# EasyEDA Pro project ProPrj_光伏汇流箱温度监控物联网网关_2026-04-27.epro

# Schematic 模板
Assembly Variant: Basic; Board Name: 模板; Create Date: 2026-04-27; Page Name: P1; Project Name: 模板; Schematic Name: 模板; Update Date: 2026-04-27; BladeWidth: 10; Company: 嘉立创EDA; Page Size: A4; RegionStart: 1; ShowBorder: 1; TitleBlock: 1; TitleBlockPosition: 3; Version: V1.0; XRegionCount: 6; YRegionCount: 4
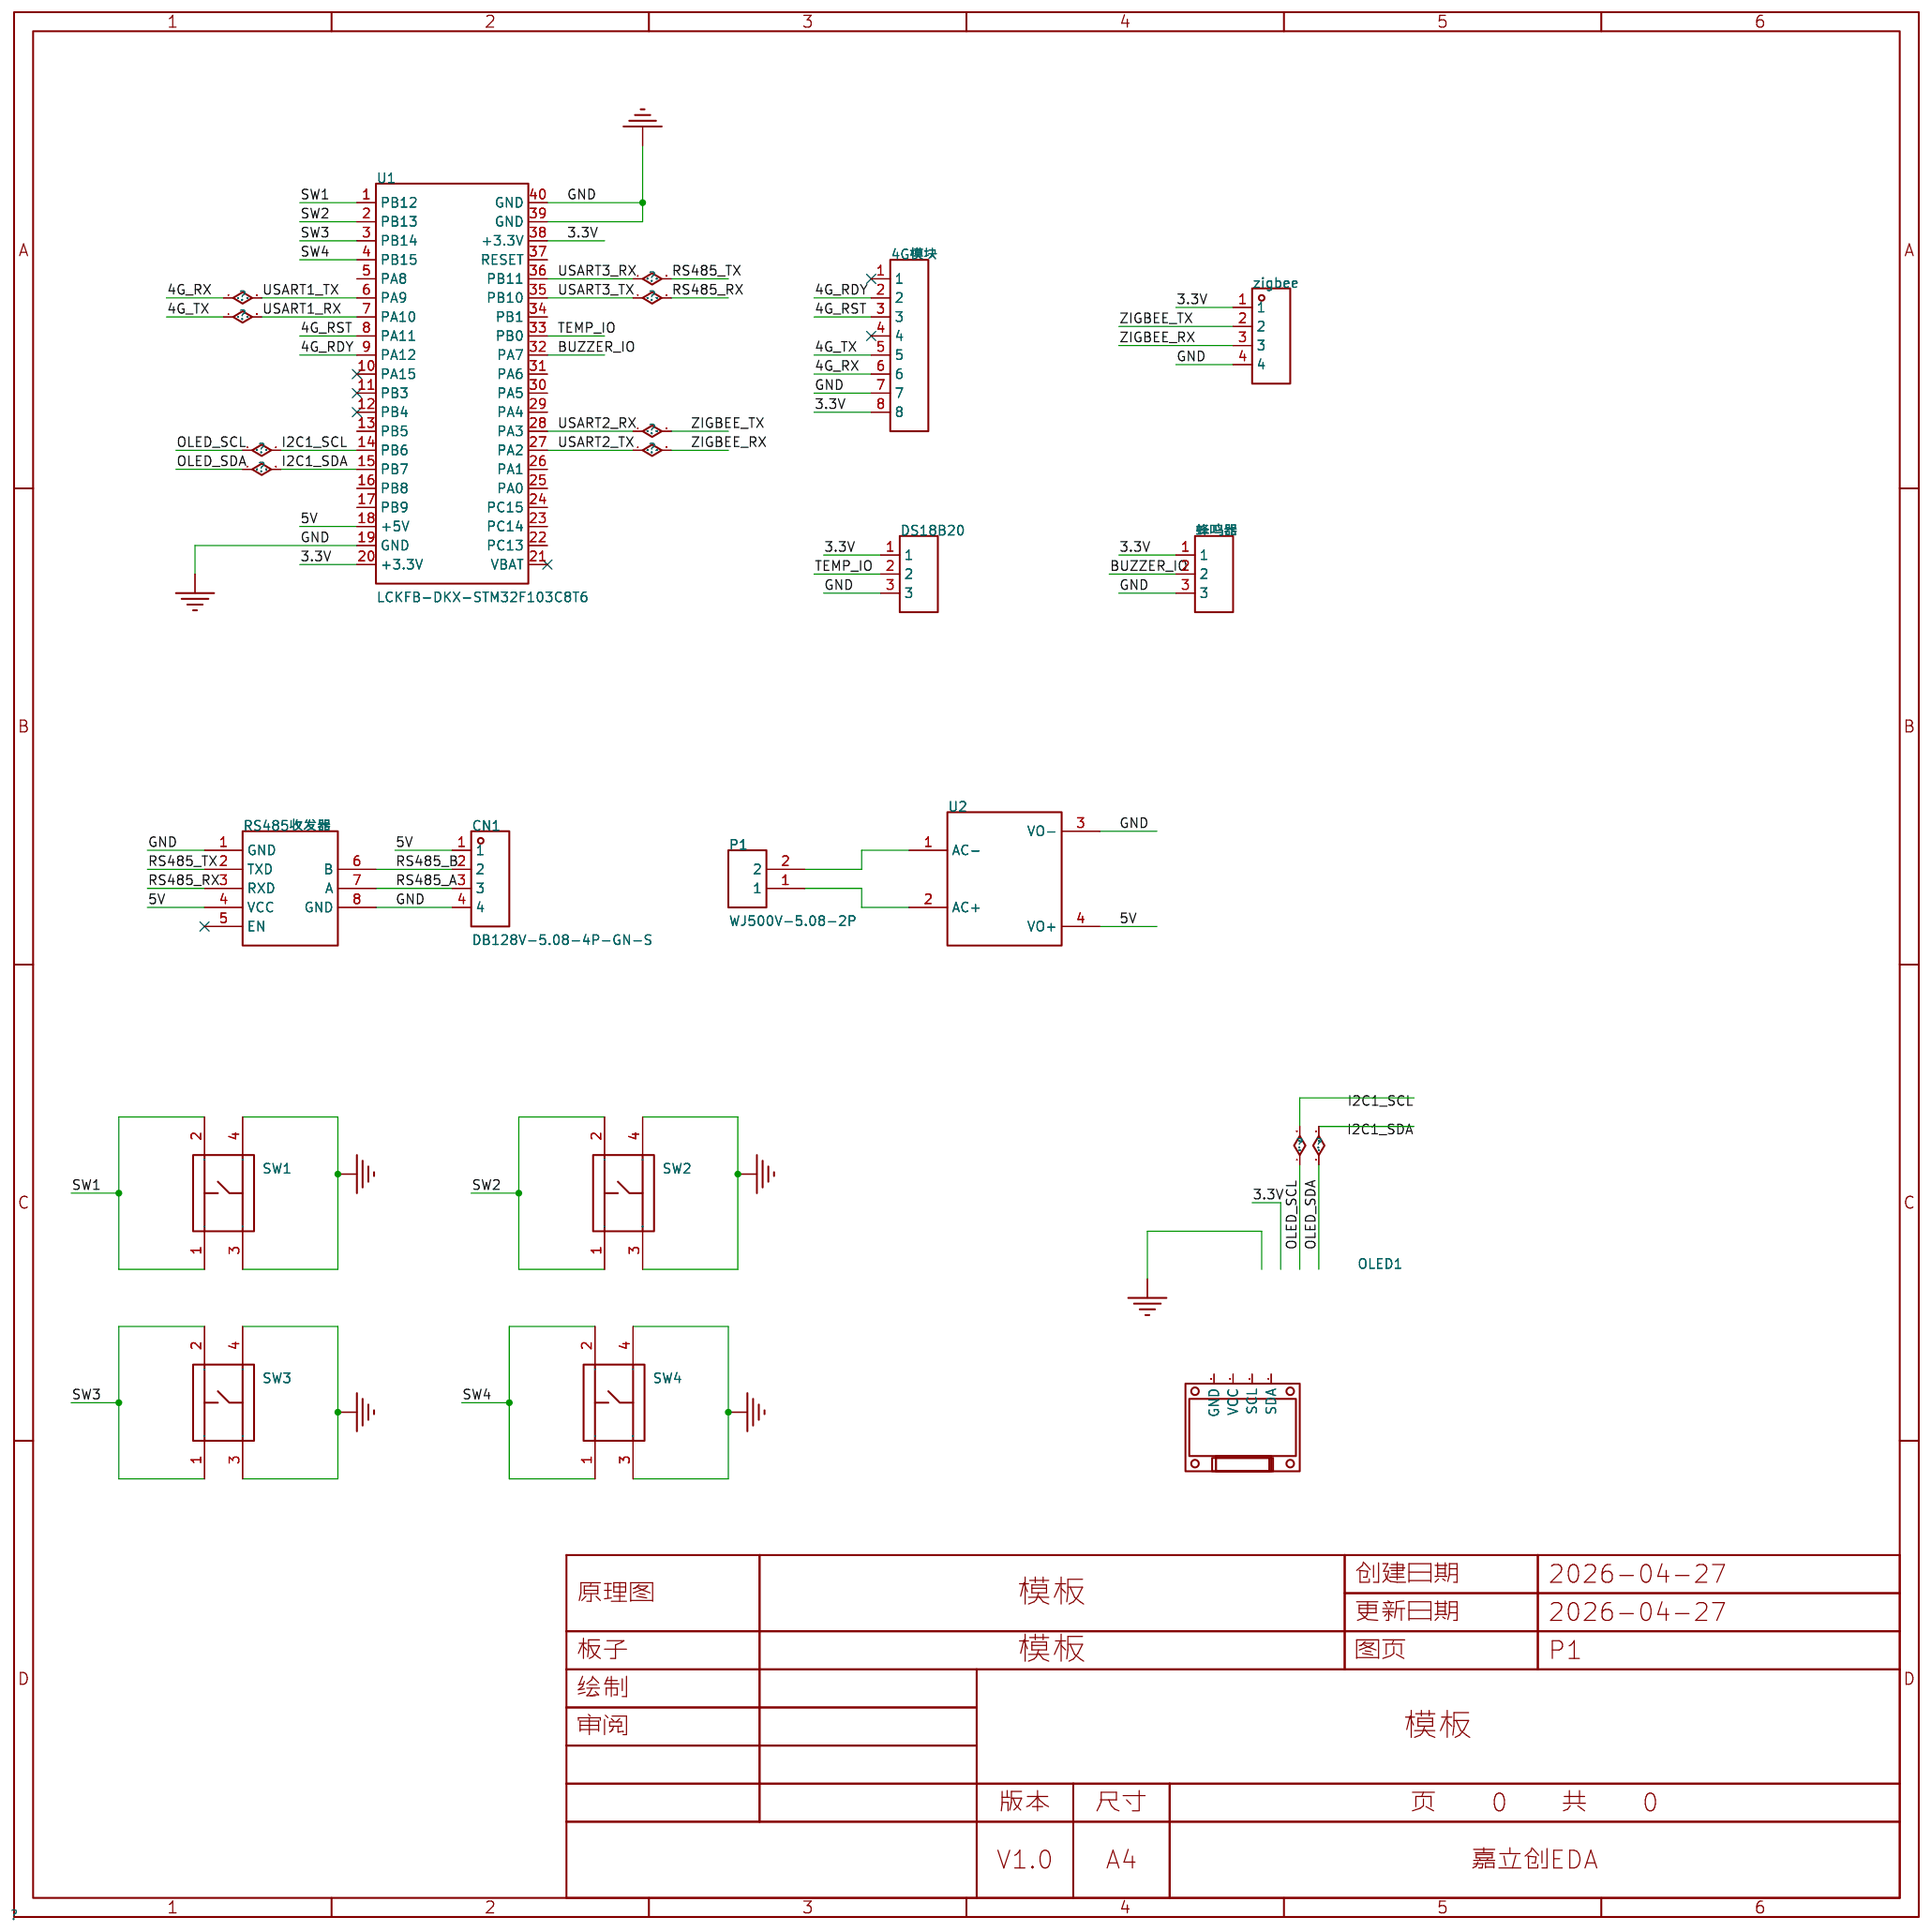
[diagram p0: schematic sheet]

## Parts
4G模块  -  [HDR-TH_8P-P2.54-V-F-1]
CN1  DB128V-5.08-4P-GN-S  [CONN-TH_4P-P5.08_DIBO_DB128V-5.08]
DS18B20  -  [HDR-TH_3P-P2.54-V-F]
OLED1  -  [0.96OLED_4P]
P1  WJ500V-5.08-2P  [CONN-TH_2P-P5.00_WJ500V-5.08-2P]
RS485收发器  -  [MAX13487模块]
SW1  K2-1102DP-C4SW-04  [KEY-TH_4P-L6.0-W6.0-P4.50-LS6.50]
SW2  K2-1102DP-C4SW-04  [KEY-TH_4P-L6.0-W6.0-P4.50-LS6.50]
SW3  K2-1102DP-C4SW-04  [KEY-TH_4P-L6.0-W6.0-P4.50-LS6.50]
SW4  K2-1102DP-C4SW-04  [KEY-TH_4P-L6.0-W6.0-P4.50-LS6.50]
U1  LCKFB-DKX-STM32F103C8T6  [CONN-TH_L53.3-W22.9_STM32F103C8T6-CARD]
U2  -  [HLK-5M05]
zigbee  -  [HDR-TH_4P-P2.54-V-F]
蜂鸣器  -  [HDR-TH_3P-P2.54-V-F]

## Library data of the parts
4G模块 = HDR-F_2.54_1x8P: Supplier Part: C27438; Supplier Footprint: 插件
CN1 = DB128V-5.08-4P-GN-S: 结构:1x4P;间距:5.08mm;颜色:绿色;安装方式:直插;排数:1;每排PIN数:4;额定电流:16A;额定电压:300V;线规 - AWG:12~22;线规 - 平方毫米:2.5;工作温度:-40℃~+105℃;; LCSC Part Name: 1x4P 5.08mm 直插 排数:1 每排P数:4; Supplier Part: C2915641; Manufacturer: DORABO(地博电气); Supplier Footprint: 插件,P=5.08mm; JLCPCB Part Class: Extended Part; Datasheet: https://item.szlcsc.com/datasheet/DB128V-5.08-4P-GN-S/3209397.html; Supplier: LCSC; Number of Positions or Pins: 1x4P; Pitch: 5.08mm; Color: 绿色; Mounting Type: 直插; Number of Pins: 4P; Number of Rows: 1; Number of PINs Per Row: 4; Screw Specification: M2.5; Current Rating: 16A; Voltage Rating (Max): 300V; Wire Gauge - AWG: 12~22; Wire Gauge - mm2: 2.5; Operating Temperature: -40℃~+105℃
DS18B20 蜂鸣器 = HDR-F_2.54_1x3P: Supplier Part: C541850; Supplier Footprint: 插件
OLED1 = 0.96OLED模块_4P: Supplier Footprint: 插件
P1 = WJ500V-5.08-2P: 结构:1x2P;间距:5.08mm;颜色:绿色;安装方式:直插;额定电流:18A;额定电压:250V;排数:1;线规 - AWG:14~30;线规 - 平方毫米:2.5;每排PIN数:2;触头材质:-;触头镀层:-;工作温度范围:-40℃~+105℃;焊接温度(最大值):-;; LCSC Part Name: 1x2P 5.08mm 直插 排数:1 每排P数:2; Supplier Part: C8465; Manufacturer: KANGNEX(康奈克斯电气); Supplier Footprint: 插件,P=5.08mm; JLCPCB Part Class: Extended Part; Datasheet: https://atta.szlcsc.com/upload/public/pdf/source/20191225/C8465_02D34CE5B5B4A53DF5891601D97FA9F4.pdf; Supplier: LCSC; Structure: 1x2P; Pitch: 5.08mm; Color: 绿色; Mounting Style: 直插; Current Rating (Max): 18A; Voltage Rating (Max): 250V; Number of Pins: 2P; Number of Rows: 1; Wire Gauge - AWG: 14~30; Wire Gauge - mm2: 2.5; Number of PINs Per Row: 2; Operating Temperature Range: -40℃~+105℃; Screw Specification: M2.5
RS485收发器 = MAX13487模块
SW1-SW4 = K2-1102DP-C4SW-04: 电路结构:单刀单掷;按钮形状:圆形按钮;作用力:2.5N;安装方式:直插;开关长度:6mm;开关宽度:6mm;开关高度:5mm;触点电流:50mA;额定电压:12V;带灯:-;工作寿命:10万次;; LCSC Part Name: 轻触按键开关6*6*5; Supplier Part: C110153; Manufacturer: 韩国韩荣; Supplier Footprint: 插件-4P,6x6mm; JLCPCB Part Class: Extended Part; Datasheet: https://item.szlcsc.com/datasheet/K2-1102DP-C4SW-04/111374.html; Supplier: LCSC; Circuit: 单刀单掷; Actuator Style: 圆形按钮; Operating Force: 2.5N; Mounting Type: 直插; Length: 6mm; Width: 6mm; Switch Height: 5mm; Contact Current: 50mA; Voltage Rating: 12V; Life: 10万次; Operating Temperature: -25℃~+85℃
U1 = LCKFB-DKX-STM32F103C8T6: 搭载Contex M3内核,程序存储容量64KB,RAM总容量20KB,最高72MHz主频,提供高效的计算能力和稳定的运行环境。; LCSC Part Name: 立创·地阔星-STM32F103C8T6开发板; Supplier Part: C22396880; Manufacturer: 立创开发板; JLCPCB Part Class: Extended Part; Datasheet: https://item.szlcsc.com/datasheet/LCKFB-DKX-STM32F103C8T6/24005615.html; Supplier: LCSC
U2 = HLK-5M05
zigbee = HDR-F_2.54_1x4P: Supplier Part: C2718488; Supplier Footprint: 插件

## Nets
3.3V: 4G模块.8 DS18B20.1 U1.20(+3.3V) U1.38(+3.3V) zigbee.1 蜂鸣器.1
5V: CN1.1 RS485收发器.4(VCC) U1.18(+5V) U2.4(VO+)
GND: 4G模块.7 CN1.4 DS18B20.3 RS485收发器.1(GND) RS485收发器.8(GND) SW1.3 SW1.4 SW2.3 SW2.4 SW3.3 SW3.4 SW4.3 SW4.4 U1.19(GND) U1.39(GND) U1.40(GND) U2.3(VO-) zigbee.4 蜂鸣器.3
4G_RDY: 4G模块.2 U1.9(PA12)
4G_RST: 4G模块.3 U1.8(PA11)
4G_RX: 4G模块.6 U1.6(PA9)
4G_TX: 4G模块.5 U1.7(PA10)
BUZZER_IO: U1.32(PA7) 蜂鸣器.2
I2C1_SCL: U1.14(PB6)
I2C1_SDA: U1.15(PB7)
RS485_A: CN1.3 RS485收发器.7(A)
RS485_B: CN1.2 RS485收发器.6(B)
RS485_RX: RS485收发器.3(RXD) U1.35(PB10)
RS485_TX: RS485收发器.2(TXD) U1.36(PB11)
SW1: SW1.1 SW1.2 U1.1(PB12)
SW2: SW2.1 SW2.2 U1.2(PB13)
SW3: SW3.1 SW3.2 U1.3(PB14)
SW4: SW4.1 SW4.2 U1.4(PB15)
TEMP_IO: DS18B20.2 U1.33(PB0)
USART2_RX: U1.28(PA3) zigbee.2
USART2_TX: U1.27(PA2) zigbee.3
$1N86: P1.2 U2.1(AC-)
$1N87: P1.1 U2.2(AC+)

Not connected (* = marked no-connect by the designer): 4G模块 1* 4*; OLED1 1(GND) 2(VCC) 3(SCL) 4(SDA); RS485收发器 5(EN)*; U1 5(PA8) 10(PA15)* 11(PB3)* 12(PB4)* 13(PB5) 16(PB8) 17(PB9) 21(VBAT)* 22(PC13) 23(PC14) 24(PC15) 25(PA0) 26(PA1) 29(PA4) 30(PA5) 31(PA6) 34(PB1) 37(RESET)

# Board 模板
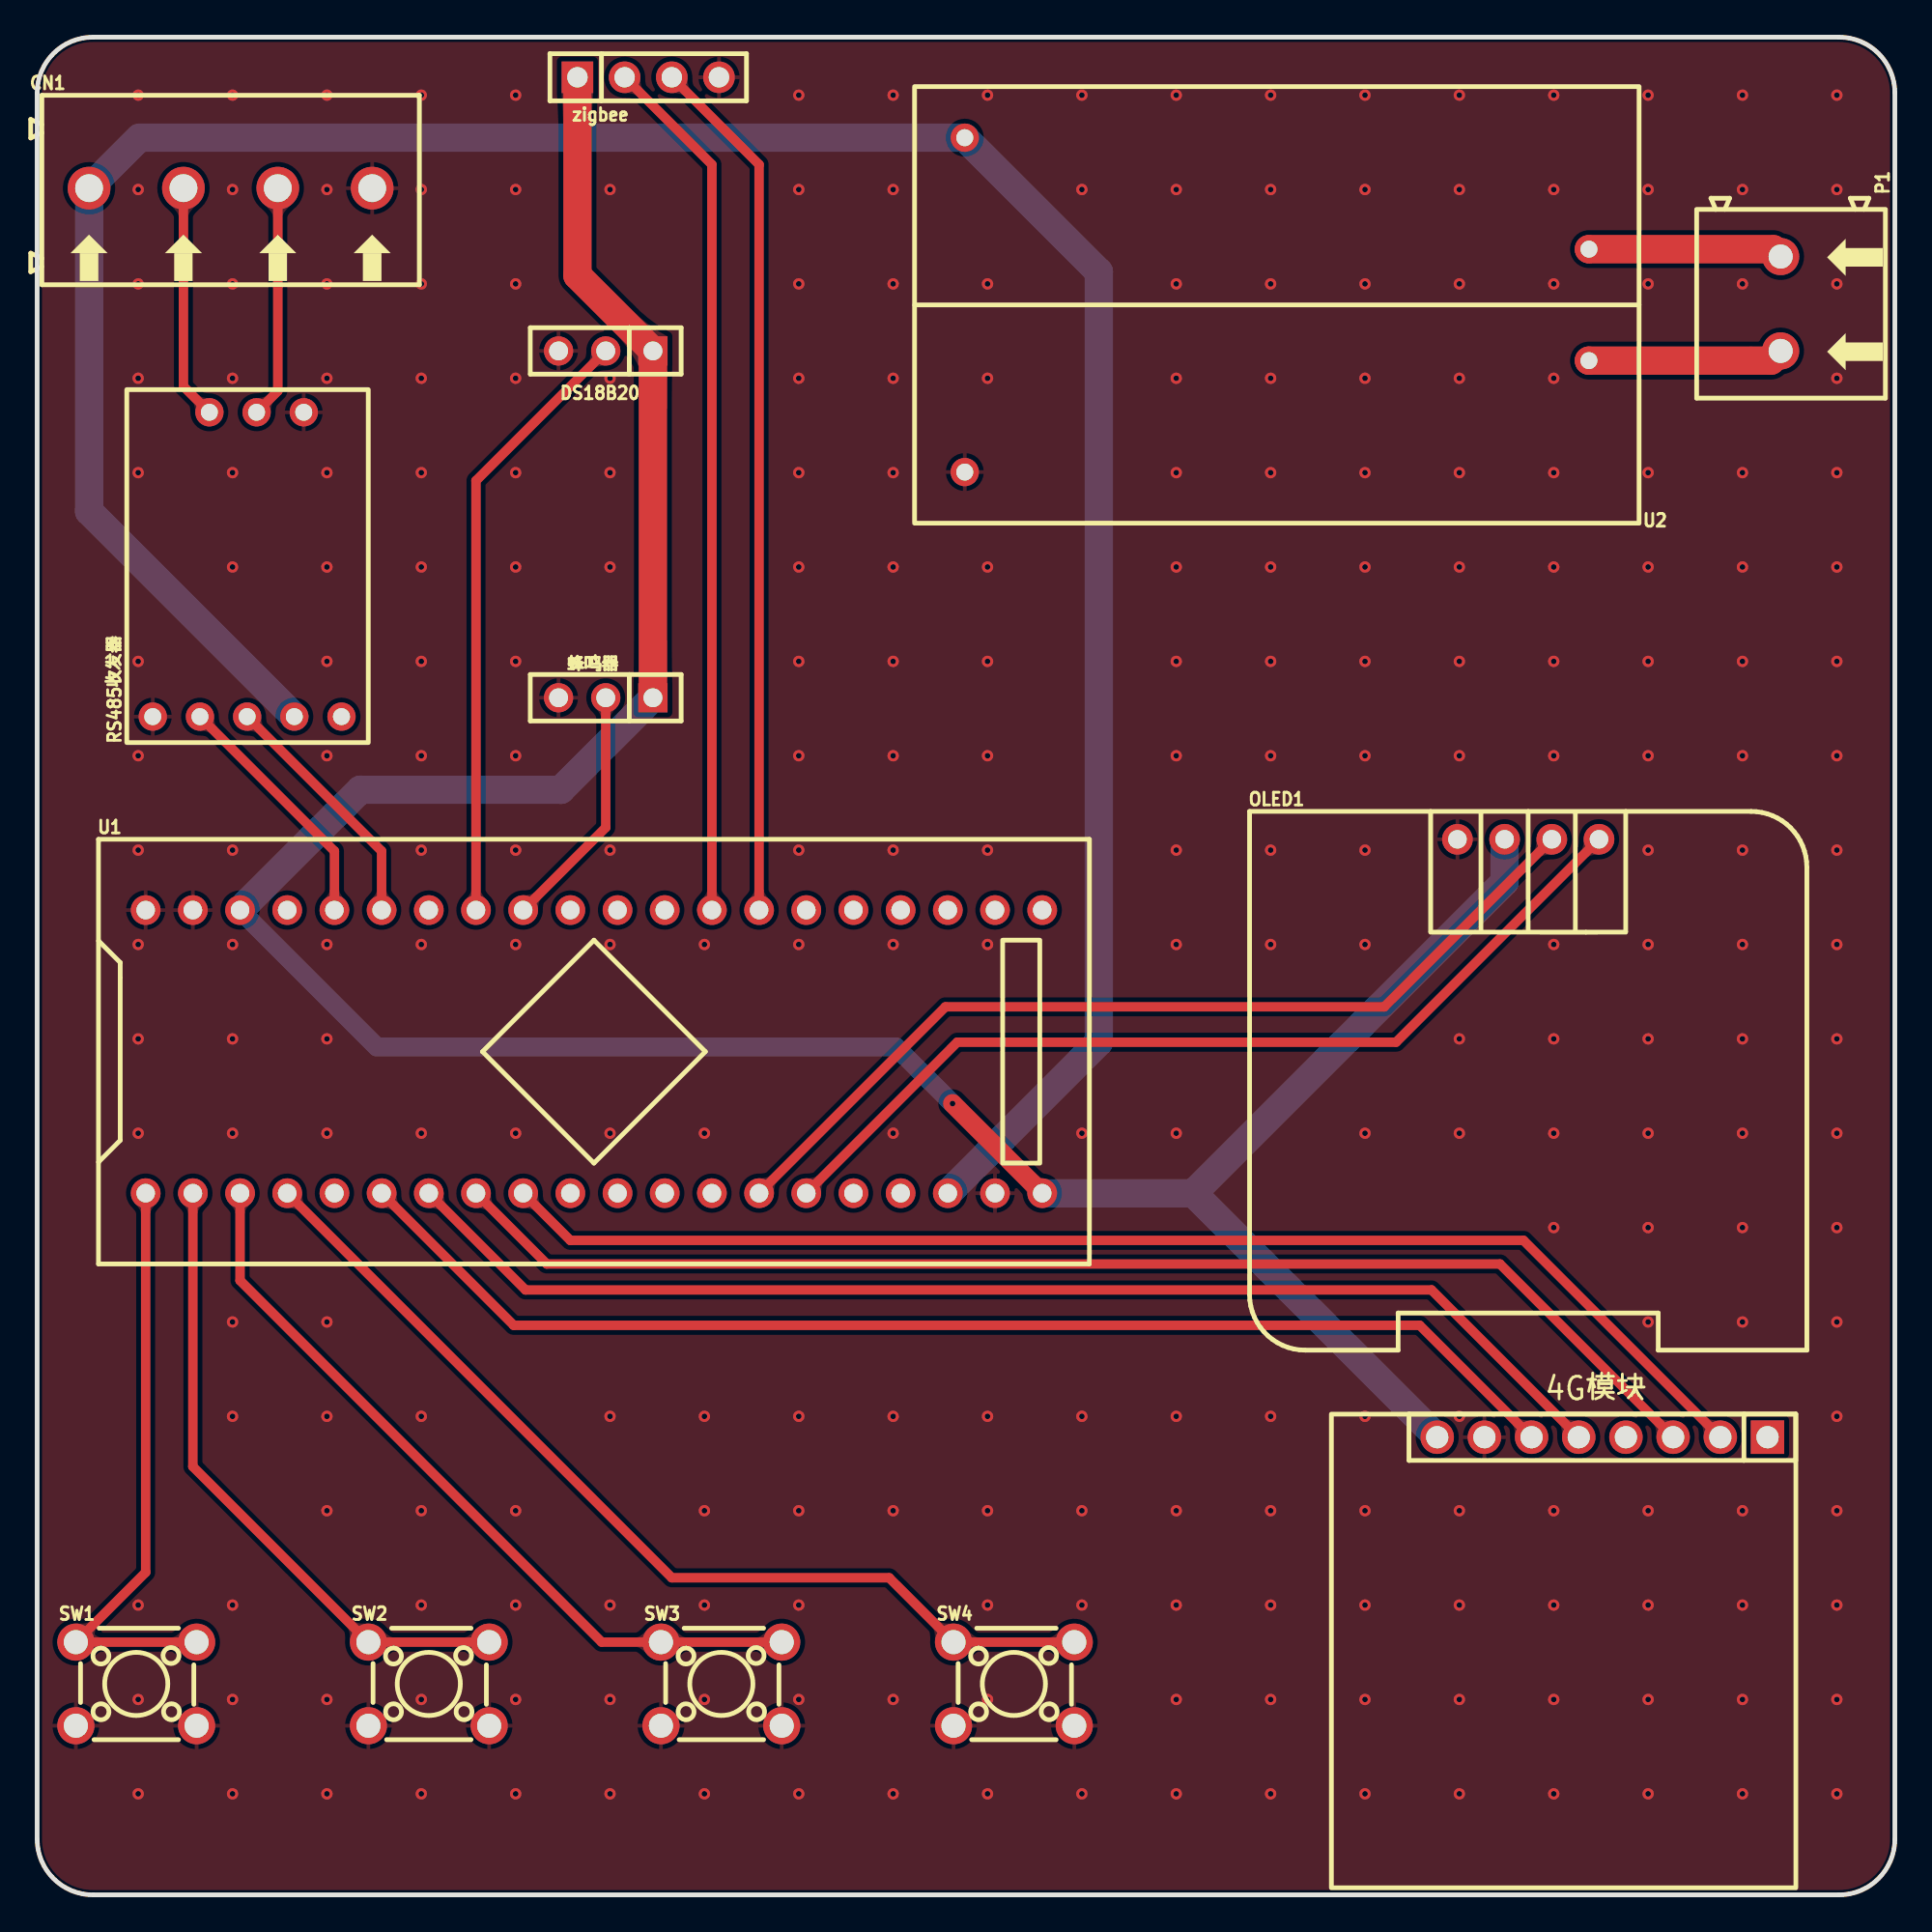
[diagram p1: board, top side]
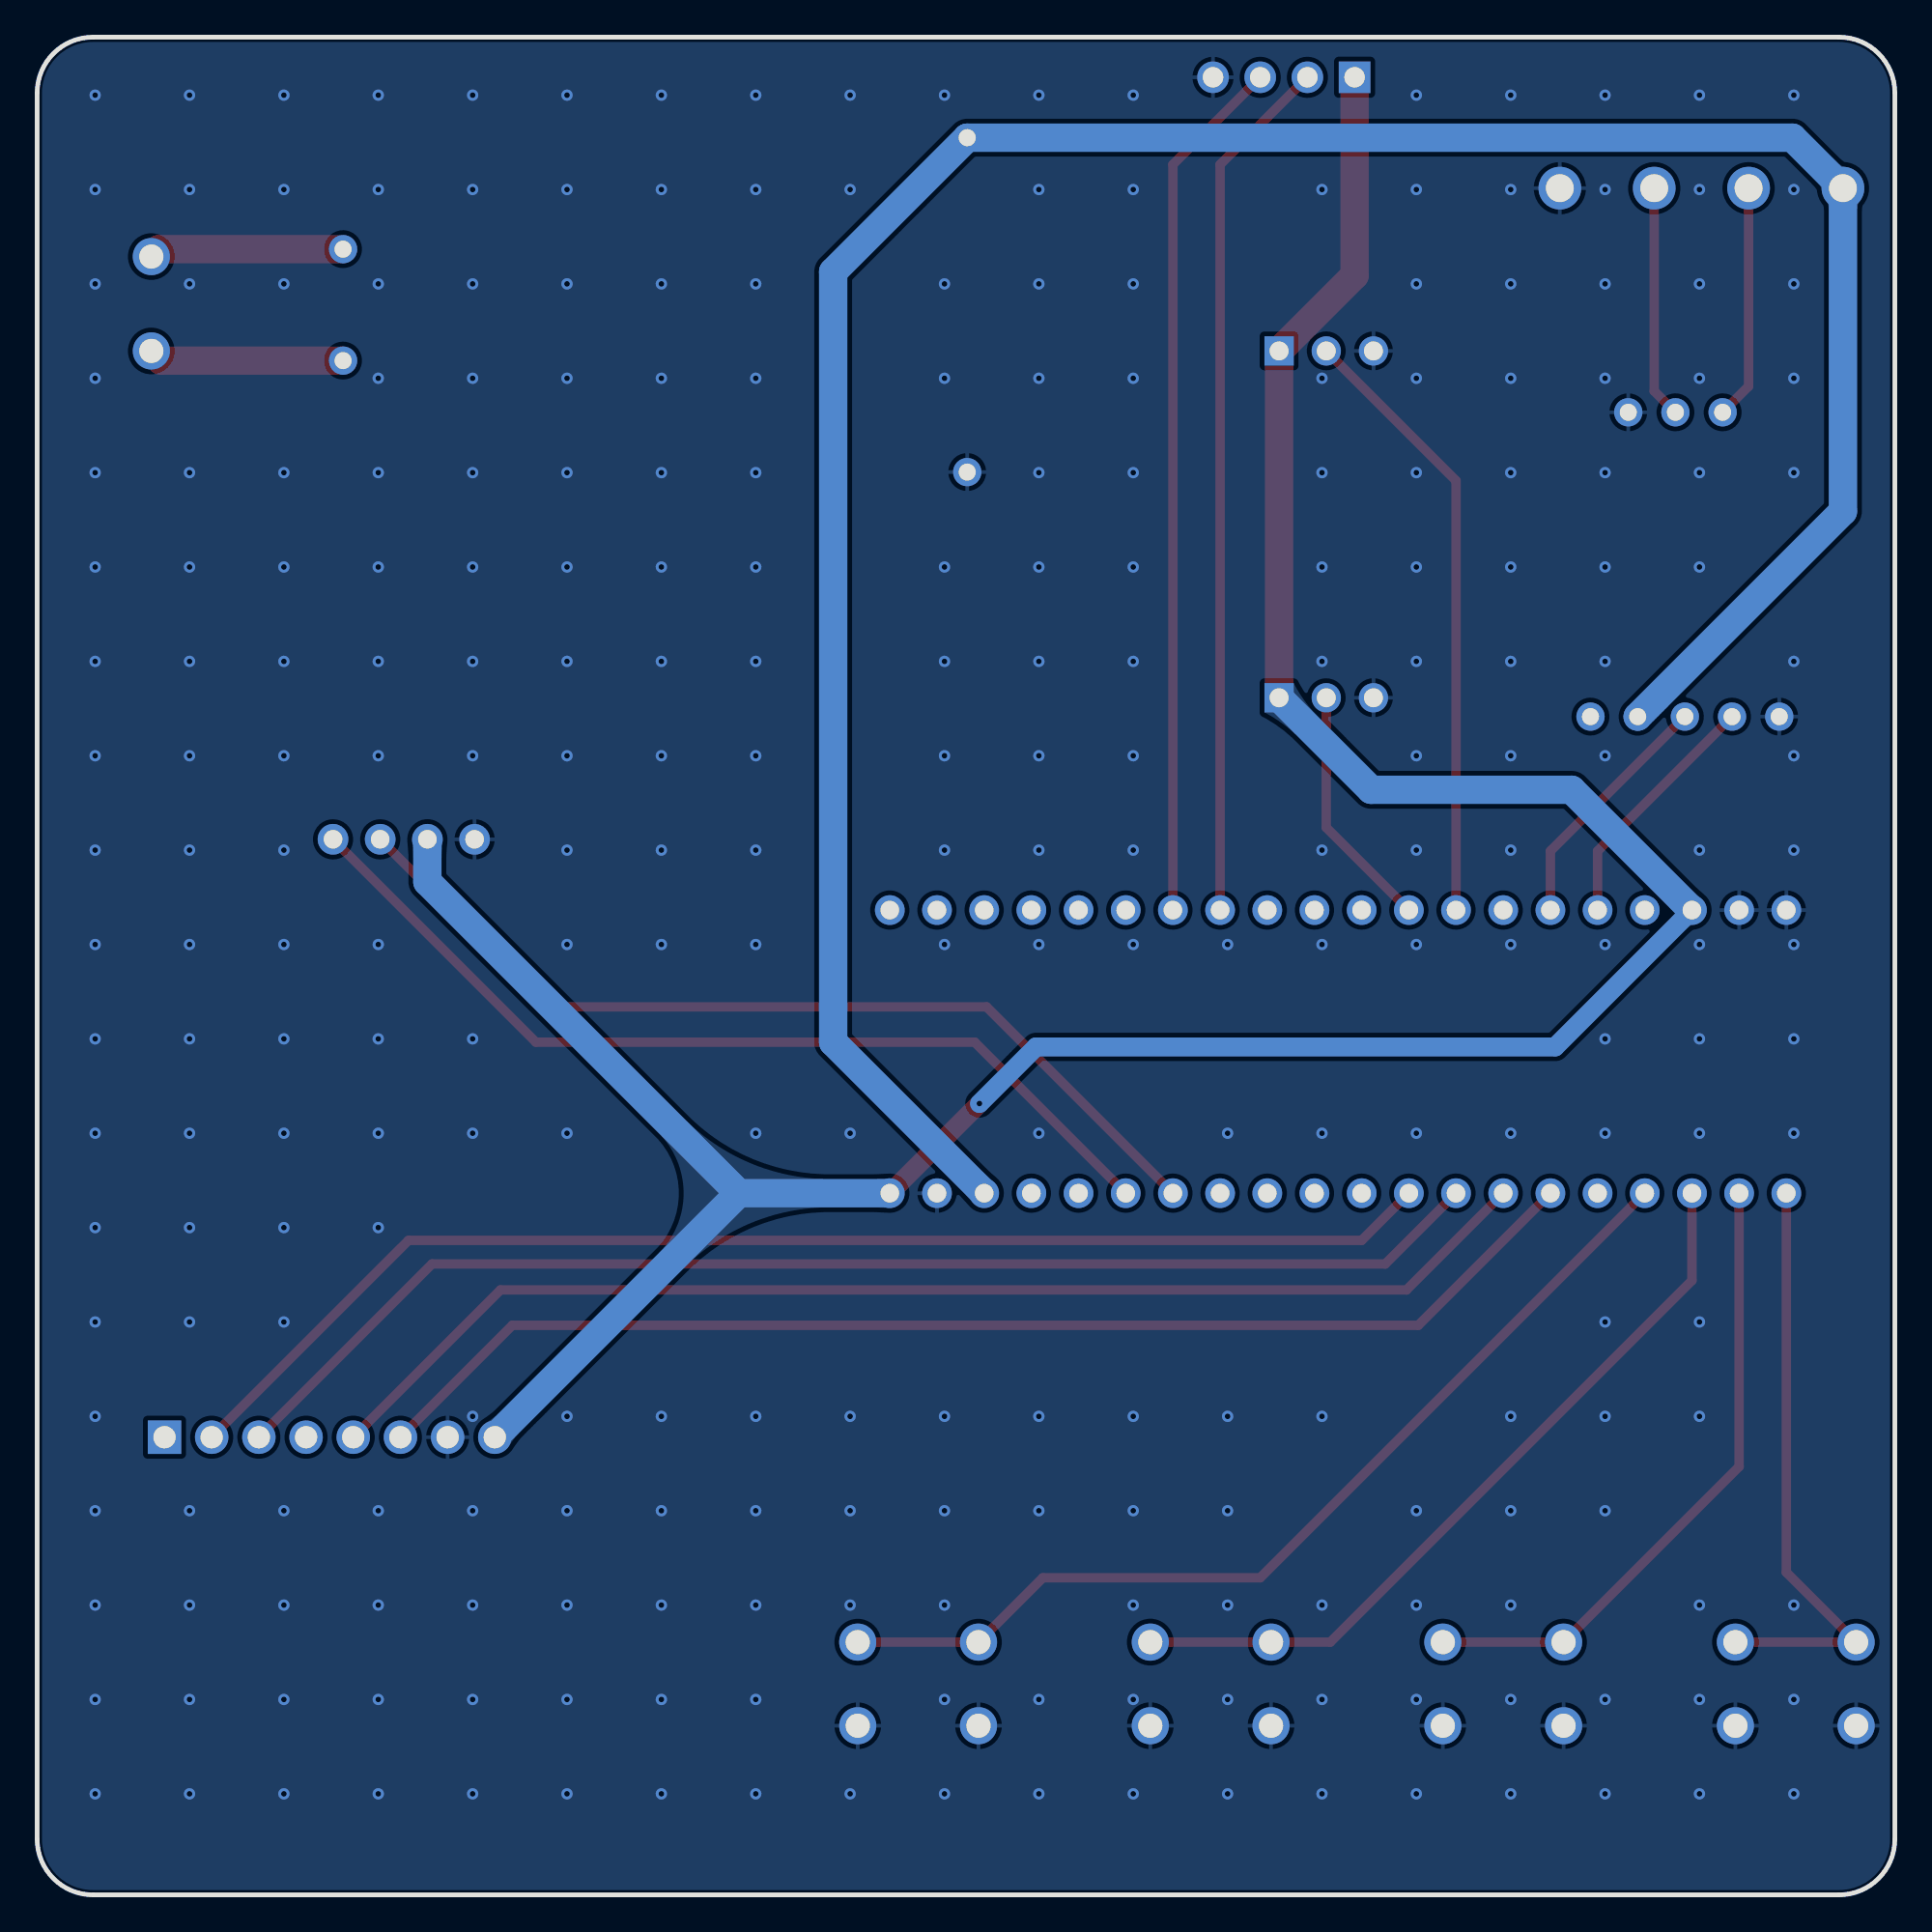
[diagram p2: board, bottom side, seen from below]

Outline 100 x 100 mm; copper layers: Top Layer, Bottom Layer. Coordinates in mm from the lower left corner of the outline.
Outline path: 0,97 0,3 arc(0.88,0.88) 3,0 97,0 arc(99.12,0.88) 100,3 100,97 arc(99.12,99.12) 97,100 3,100 arc(0.88,99.12) 0,97
Stack: Top Layer 0.035mm / Dielectric1 1.51mm FR4 er 4.5 / Bottom Layer 0.035mm

## Design rules (mm)
spacing copperThickness1oz (default): track to track 0.102, other pairs 0.152 to 0.3
spacing copperThickness2oz: track to track 0.203, other pairs 0.152 to 0.3
track width copperThickness1oz (default): min 0.127, default 0.254, max 2.54
track width copperThickness2oz: min 0.203, default 0.254, max 2.54
differential pair differentialPair (default): width min 0.127, default 0.254, max 2.54; gap min 0.152, default 0.152
net GND uses copperRegion

## Placement (name value [footprint] x y rotation side)
4G模块  -  [HDR-TH_8P-P2.54-V-F-1]  84.25 24.64 180 top
CN1  DB128V-5.08-4P-GN-S  [CONN-TH_4P-P5.08_DIBO_DB128V-5.08]  10.41 91.87 0 top
DS18B20  -  [HDR-TH_3P-P2.54-V-F]  30.61 83.11 180 top
OLED1  -  [0.96OLED_4P]  80.26 56.82 0 top
P1  WJ500V-5.08-2P  [CONN-TH_2P-P5.00_WJ500V-5.08-2P]  93.85 85.65 270 top
RS485收发器  -  [MAX13487模块]  4.83 62.03 90 top
SW1  K2-1102DP-C4SW-04  [KEY-TH_4P-L6.0-W6.0-P4.50-LS6.50]  5.33 11.35 0 top
SW2  K2-1102DP-C4SW-04  [KEY-TH_4P-L6.0-W6.0-P4.50-LS6.50]  21.08 11.35 0 top
SW3  K2-1102DP-C4SW-04  [KEY-TH_4P-L6.0-W6.0-P4.50-LS6.50]  36.83 11.35 0 top
SW4  K2-1102DP-C4SW-04  [KEY-TH_4P-L6.0-W6.0-P4.50-LS6.50]  52.58 11.35 0 top
U1  LCKFB-DKX-STM32F103C8T6  [CONN-TH_L53.3-W22.9_STM32F103C8T6-CARD]  29.97 45.39 0 top
U2  -  [HLK-5M05]  86.23 73.84 180 top
zigbee  -  [HDR-TH_4P-P2.54-V-F]  32.89 97.84 0 top
蜂鸣器  -  [HDR-TH_3P-P2.54-V-F]  30.61 64.44 180 top

## Footprints (pads in the part's own frame, mm; a bottom-side part is the same pattern mirrored in y, then rotated)
0.96OLED_4P
  round 1.65 hole 1: 1(-3.81,-0.002) 2(-1.27,0.002) 3(1.27,0.002) 4(3.81,0.002)
CONN-TH_2P-P5.00_WJ500V-5.08-2P
  round 2 hole 1.3: 1(-2.54,0) 2(2.54,0)
CONN-TH_4P-P5.08_DIBO_DB128V-5.08
  round 2.3 hole 1.5: 1(-7.62,0) 2(-2.54,0) 3(2.54,0) 4(7.62,0)
CONN-TH_L53.3-W22.9_STM32F103C8T6-CARD
  round 1.6 hole 1: 1(-24.13,-7.62) 2(-21.59,-7.62) 3(-19.05,-7.62) 4(-16.51,-7.62) 5(-13.97,-7.62) 6(-11.43,-7.62) 7(-8.89,-7.62) 8(-6.35,-7.62) 9(-3.81,-7.62) 10(-1.27,-7.62) 11(1.27,-7.62) 12(3.81,-7.62) 13(6.35,-7.62) 14(8.89,-7.62) 15(11.43,-7.62) 16(13.97,-7.62) 17(16.51,-7.62) 18(19.05,-7.62) 19(21.59,-7.62) 20(24.13,-7.62) 21(24.13,7.62) 22(21.59,7.62) 23(19.05,7.62) 24(16.51,7.62) 25(13.97,7.62) 26(11.43,7.62) 27(8.89,7.62) 28(6.35,7.62) 29(3.81,7.62) 30(1.27,7.62) 31(-1.27,7.62) 32(-3.81,7.62) 33(-6.35,7.62) 34(-8.89,7.62) 35(-11.43,7.62) 36(-13.97,7.62) 37(-16.51,7.62) 38(-19.05,7.62) 39(-21.59,7.62) 40(-24.13,7.62)
HDR-TH_3P-P2.54-V-F
  rect 1.575x1.575 hole 1.02: 1(-2.54,0)
  round 1.575 hole 1.02: 2(0,0) 3(2.54,0)
HDR-TH_4P-P2.54-V-F
  rect 1.7x1.7 hole 1.1: 1(-3.81,0)
  round 1.7 hole 1.1: 2(-1.27,0) 3(1.27,0) 4(3.81,0)
HDR-TH_8P-P2.54-V-F-1
  rect 1.8x1.8 hole 1.2: 1(-8.89,0)
  round 1.8 hole 1.2: 2(-6.35,0) 3(-3.81,0) 4(-1.27,0) 5(1.27,0) 6(3.81,0) 7(6.35,0) 8(8.89,0)
HLK-5M05
  round 1.524 hole 0.914: 1(2.7,-8.75) 2(2.7,-14.75) 3(36.3,-2.75) 4(36.3,-20.75)
KEY-TH_4P-L6.0-W6.0-P4.50-LS6.50
  round 2 hole 1.3: 1(-3.25,2.25) 2(3.25,2.25) 3(-3.25,-2.25) 4(3.25,-2.25)
MAX13487模块
  round 1.524 hole 0.914: 1(1.397,-1.397) 2(1.397,-3.937) 3(1.397,-6.477) 4(1.397,-9.017) 5(1.397,-11.557) 6(17.78,-4.445) 7(17.78,-6.985) 8(17.78,-9.525)

## Nets
As in the schematic, except:
3.3V: 4G模块.8 DS18B20.1 OLED1.2 U1.20 U1.38 zigbee.1 蜂鸣器.1
GND: 4G模块.7 CN1.4 DS18B20.3 OLED1.1 RS485收发器.1 RS485收发器.8 SW1.3 SW1.4 SW2.3 SW2.4 SW3.3 SW3.4 SW4.3 SW4.4 U1.19 U1.39 U1.40 U2.3 zigbee.4 蜂鸣器.3
I2C1_SCL: OLED1.3 U1.14
I2C1_SDA: OLED1.4 U1.15

Pads without a net: 4G模块 1 4; RS485收发器 5; U1 5 10 11 12 13 16 17 21 22 23 24 25 26 29 30 31 34 37

## Via types
v1: diameter 0.61, hole 0.305, Top Layer to Bottom Layer, 277 vias

## Routing (per net, layer and track width the routed paths; a pad name or vN(x,y) marks a point on that pad's centre or on a via; arc(x,y) is an arc through that point)
3.3V: length 164.2
  Top Layer w1.016: v1(49.28,42.6) U1.20
  Top Layer w1.524: 蜂鸣器.1 DS18B20.1 29.08,87.17 zigbee.1
  Bottom Layer w1.016: U1.38 18.29,45.64 46.23,45.64 v1(49.28,42.6)
  Bottom Layer w1.524: U1.38 17.4,59.49 28.19,59.49 蜂鸣器.1 ; OLED1.2 78.99,54.53 62.23,37.77 ; 62.23,37.77 U1.20 ; 62.23,37.77 4G模块.8
5V: length 144.5
  Bottom Layer w1.524: 13.84,63.42 2.79,74.47 CN1.1 5.51,94.59 U2.4 57.15,87.37 57.15,45.9 U1.18
GND:
  vias: v1(5.44,96.88) v1(5.44,91.8) v1(5.44,86.72) v1(5.44,81.64) v1(5.44,76.56) v1(5.44,66.4) v1(5.44,61.32) v1(5.44,56.24) v1(5.44,51.16) v1(5.44,46.08) v1(5.44,41) v1(5.44,15.6) v1(5.44,10.52) v1(5.44,5.44) v1(10.52,96.88) v1(10.52,91.8) v1(10.52,86.72) v1(10.52,81.64) v1(10.52,76.56) v1(10.52,71.48) v1(10.52,56.24) v1(10.52,51.16) v1(10.52,46.08) v1(10.52,41) v1(10.52,30.84) v1(10.52,25.76) v1(10.52,15.6) v1(10.52,10.52) v1(10.52,5.44) v1(15.6,96.88) v1(15.6,91.8) v1(15.6,86.72) v1(15.6,81.64) v1(15.6,76.56) v1(15.6,71.48) v1(15.6,66.4) v1(15.6,61.32) v1(15.6,51.16) v1(15.6,46.08) v1(15.6,41) v1(15.6,30.84) v1(15.6,25.76) v1(15.6,20.68) v1(15.6,10.52) v1(15.6,5.44) v1(20.68,96.88) v1(20.68,91.8) v1(20.68,86.72) v1(20.68,81.64) v1(20.68,76.56) v1(20.68,71.48) v1(20.68,66.4) v1(20.68,61.32) v1(20.68,56.24) v1(20.68,51.16) v1(20.68,41) v1(20.68,25.76) v1(20.68,20.68) v1(20.68,15.6) v1(20.68,10.52) v1(20.68,5.44) v1(25.76,96.88) v1(25.76,91.8) v1(25.76,86.72) v1(25.76,81.64) v1(25.76,76.56) v1(25.76,71.48) v1(25.76,66.4) v1(25.76,61.32) v1(25.76,56.24) v1(25.76,51.16) v1(25.76,41) v1(25.76,20.68) v1(25.76,15.6) v1(25.76,10.52) v1(25.76,5.44) v1(30.84,91.8) v1(30.84,81.64) v1(30.84,76.56) v1(30.84,71.48) v1(30.84,66.4) v1(30.84,56.24) v1(30.84,51.16) v1(30.84,41) v1(30.84,25.76) v1(30.84,15.6) v1(30.84,10.52) v1(30.84,5.44) v1(35.92,51.16) v1(35.92,41) v1(35.92,25.76) v1(35.92,20.68) v1(35.92,15.6) v1(35.92,10.52) v1(35.92,5.44) v1(41,96.88) v1(41,91.8) v1(41,86.72) v1(41,81.64) v1(41,76.56) v1(41,71.48) v1(41,66.4) v1(41,61.32) v1(41,56.24) v1(41,51.16) v1(41,25.76) v1(41,20.68) v1(41,15.6) v1(41,10.52) v1(41,5.44) v1(46.08,96.88) v1(46.08,91.8) v1(46.08,86.72) v1(46.08,81.64) v1(46.08,76.56) v1(46.08,71.48) v1(46.08,66.4) v1(46.08,61.32) v1(46.08,56.24) v1(46.08,51.16) v1(46.08,41) v1(46.08,25.76) v1(46.08,20.68) v1(46.08,10.52) v1(46.08,5.44) v1(51.16,96.88) v1(51.16,86.72) v1(51.16,81.64) v1(51.16,71.48) v1(51.16,66.4) v1(51.16,61.32) v1(51.16,56.24) v1(51.16,51.16) v1(51.16,25.76) v1(51.16,20.68) v1(51.16,15.6) v1(51.16,10.52) v1(51.16,5.44) v1(56.24,96.88) v1(56.24,91.8) v1(56.24,41) v1(56.24,25.76) v1(56.24,20.68) v1(56.24,15.6) v1(56.24,5.44) v1(61.32,96.88) v1(61.32,91.8) v1(61.32,86.72) v1(61.32,81.64) v1(61.32,76.56) v1(61.32,71.48) v1(61.32,66.4) v1(61.32,61.32) v1(61.32,56.24) v1(61.32,51.16) v1(61.32,41) v1(61.32,25.76) v1(61.32,20.68) v1(61.32,15.6) v1(61.32,10.52) v1(61.32,5.44) v1(66.4,96.88) v1(66.4,91.8) v1(66.4,86.72) v1(66.4,81.64) v1(66.4,76.56) v1(66.4,71.48) v1(66.4,66.4) v1(66.4,61.32) v1(66.4,56.24) v1(66.4,51.16) v1(66.4,25.76) v1(66.4,20.68) v1(66.4,15.6) v1(66.4,10.52) v1(66.4,5.44) v1(71.48,96.88) v1(71.48,91.8) v1(71.48,86.72) v1(71.48,81.64) v1(71.48,76.56) v1(71.48,71.48) v1(71.48,66.4) v1(71.48,61.32) v1(71.48,56.24) v1(71.48,51.16) v1(71.48,41) v1(71.48,25.76) v1(71.48,20.68) v1(71.48,15.6) v1(71.48,10.52) v1(71.48,5.44) v1(76.56,96.88) v1(76.56,91.8) v1(76.56,86.72) v1(76.56,81.64) v1(76.56,76.56) v1(76.56,71.48) v1(76.56,66.4) v1(76.56,61.32) v1(76.56,46.08) v1(76.56,41) v1(76.56,25.76) v1(76.56,20.68) v1(76.56,15.6) v1(76.56,10.52) v1(76.56,5.44) v1(81.64,96.88) v1(81.64,91.8) v1(81.64,86.72) v1(81.64,81.64) v1(81.64,76.56) v1(81.64,71.48) v1(81.64,66.4) v1(81.64,61.32) v1(81.64,51.16) v1(81.64,46.08) v1(81.64,41) v1(81.64,35.92) v1(81.64,20.68) v1(81.64,15.6) v1(81.64,10.52) v1(81.64,5.44) v1(86.72,96.88) v1(86.72,91.8) v1(86.72,86.72) v1(86.72,76.56) v1(86.72,71.48) v1(86.72,66.4) v1(86.72,61.32) v1(86.72,56.24) v1(86.72,51.16) v1(86.72,46.08) v1(86.72,41) v1(86.72,35.92) v1(86.72,30.84) v1(86.72,20.68) v1(86.72,15.6) v1(86.72,10.52) v1(86.72,5.44) v1(91.8,96.88) v1(91.8,91.8) v1(91.8,86.72) v1(91.8,76.56) v1(91.8,71.48) v1(91.8,66.4) v1(91.8,61.32) v1(91.8,56.24) v1(91.8,51.16) v1(91.8,46.08) v1(91.8,41) v1(91.8,35.92) v1(91.8,30.84) v1(91.8,20.68) v1(91.8,15.6) v1(91.8,10.52) v1(91.8,5.44) v1(96.88,96.88) v1(96.88,91.8) v1(96.88,86.72) v1(96.88,81.64) v1(96.88,76.56) v1(96.88,71.48) v1(96.88,66.4) v1(96.88,61.32) v1(96.88,56.24) v1(96.88,51.16) v1(96.88,46.08) v1(96.88,41) v1(96.88,35.92) v1(96.88,30.84) v1(96.88,25.76) v1(96.88,20.68) v1(96.88,15.6) v1(96.88,10.52) v1(96.88,5.44)
4G_RDY: length 69.9
  Top Layer w0.508: U1.9 28.7,35.23 80.01,35.23 4G模块.2
4G_RST: length 69.9
  Top Layer w0.508: 4G模块.3 78.74,33.96 27.43,33.96 U1.8
4G_RX: length 67.3
  Top Layer w0.508: 4G模块.6 74.42,30.66 25.65,30.66 U1.6
4G_TX: length 67.3
  Top Layer w0.508: 4G模块.5 75.06,32.56 26.29,32.56 U1.7
BUZZER_IO: length 13.3
  Top Layer w0.508: 蜂鸣器.2 30.61,57.45 U1.32
I2C1_SCL: length 50.6
  Top Layer w0.508: U1.14 48.9,47.8 72.52,47.8 OLED1.3
I2C1_SDA: length 50.6
  Top Layer w0.508: OLED1.4 73.15,45.9 49.53,45.9 U1.15
RS485_A: length 12.5
  Top Layer w0.508: RS485收发器.7 12.95,80.95 CN1.3
RS485_B: length 12.6
  Top Layer w0.508: 9.27,79.81 7.87,81.2 CN1.2
RS485_RX: length 13.4
  Top Layer w0.508: RS485收发器.3 18.54,56.19 U1.35
RS485_TX: length 13.4
  Top Layer w0.508: 8.76,63.42 16,56.19 U1.36
SW1: length 32.2
  Top Layer w0.508: U1.1 5.84,17.36 SW1.1 SW1.2
SW2: length 34.6
  Top Layer w0.508: U1.2 8.38,23.05 SW2.1 SW2.2
SW3: length 41.9
  Top Layer w0.508: U1.3 10.92,33.07 30.39,13.6 SW3.1 SW3.2
SW4: length 52.4
  Top Layer w0.508: SW4.2 SW4.1 45.86,17.07 34.16,17.07 U1.4
TEMP_IO: length 33
  Top Layer w0.508: U1.33 23.62,76.12 DS18B20.2
USART2_RX: length 46.8
  Top Layer w0.508: zigbee.2 36.32,93.14 U1.28
USART2_TX: length 46.8
  Top Layer w0.508: U1.27 38.86,93.14 zigbee.3
$1N86: length 10.5
  Top Layer w1.524: 83.53,82.59 93.33,82.59 P1.2
$1N87: length 10.5
  Top Layer w1.524: 83.53,88.59 93.45,88.59 P1.1

## Copper pours and planes (outline as drawn; the poured copper is in the pictures)
GND on Top Layer: -21.84,111.56 133.1,111.56 133.1,-14.3 -21.84,-14.3
GND on Bottom Layer: -50.42,122.48 179.2,122.48 179.2,-51.64 -50.42,-51.64

Small or netless copper shapes (teardrops, artwork), in the pictures only: 51 on Top Layer, 10 on Bottom Layer
